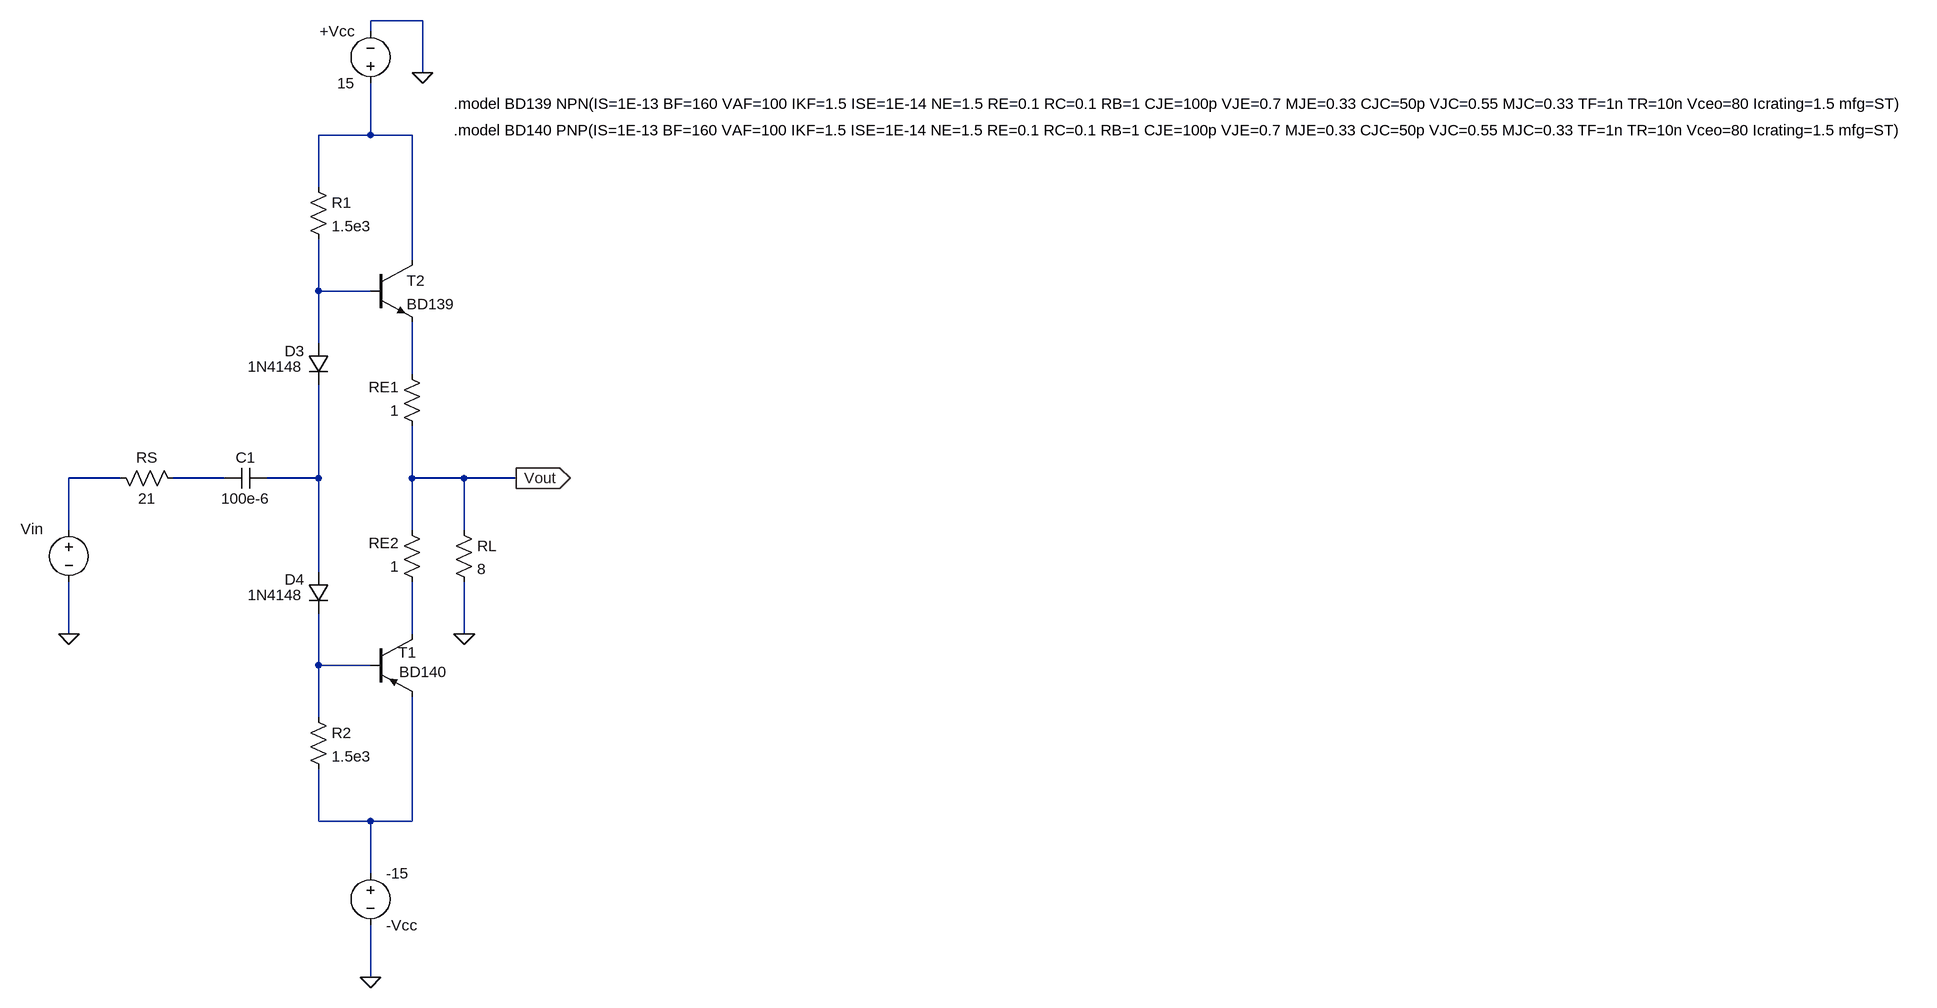
[diagram p0: schematic faz3.asc]
faz3.asc, the LTspice schematic file:
Version 4
SHEET 1 2580 1032
WIRE -688 -480 -768 -480
WIRE -768 -464 -768 -480
WIRE -688 -400 -688 -480
WIRE -768 -304 -768 -384
WIRE -768 -304 -848 -304
WIRE -704 -304 -768 -304
WIRE -848 -224 -848 -304
WIRE -704 -112 -704 -304
WIRE -848 -64 -848 -144
WIRE -768 -64 -848 -64
WIRE -848 16 -848 -64
WIRE -704 64 -704 -16
WIRE -1152 224 -1232 224
WIRE -992 224 -1072 224
WIRE -848 224 -848 80
WIRE -848 224 -928 224
WIRE -704 224 -704 144
WIRE -624 224 -704 224
WIRE -544 224 -624 224
WIRE -1232 304 -1232 224
WIRE -704 304 -704 224
WIRE -624 304 -624 224
WIRE -848 368 -848 224
WIRE -1232 464 -1232 384
WIRE -704 464 -704 384
WIRE -624 464 -624 384
WIRE -848 512 -848 432
WIRE -768 512 -848 512
WIRE -848 592 -848 512
WIRE -848 752 -848 672
WIRE -768 752 -848 752
WIRE -704 752 -704 560
WIRE -704 752 -768 752
WIRE -768 832 -768 752
WIRE -768 992 -768 912
FLAG -1232 464 0
FLAG -624 464 0
FLAG -544 224 Vout
IOPIN -544 224 Out
FLAG -688 -400 0
FLAG -768 992 0
SYMBOL cap -928 208 R90
WINDOW 0 0 32 VBottom 2
WINDOW 3 32 32 VTop 2
SYMATTR InstName C1
SYMATTR Value 100e-6
SYMBOL voltage -1232 288 R0
WINDOW 123 -74 42 Left 2
WINDOW 39 0 0 Left 0
WINDOW 0 -74 14 Left 2
WINDOW 3 -74 42 Left 2
SYMATTR InstName Vin
SYMATTR Value ""
SYMBOL res -1168 208 M90
WINDOW 0 0 56 VBottom 2
WINDOW 3 32 56 VTop 2
SYMATTR InstName RS
SYMATTR Value 21
SYMBOL npn -768 -112 R0
SYMATTR InstName T2
SYMATTR Value BD139
SYMBOL pnp -768 464 R0
WINDOW 0 43 28 Left 2
WINDOW 3 44 58 Left 2
SYMATTR InstName T1
SYMATTR Value BD140
SYMBOL res -688 160 R180
WINDOW 0 36 76 Left 2
WINDOW 3 36 40 Left 2
SYMATTR InstName RE1
SYMATTR Value 1
SYMBOL res -688 400 R180
WINDOW 0 36 76 Left 2
WINDOW 3 36 40 Left 2
SYMATTR InstName RE2
SYMATTR Value 1
SYMBOL res -640 288 R0
SYMATTR InstName RL
SYMATTR Value 8
SYMBOL voltage -768 -368 R180
WINDOW 0 24 96 Left 2
WINDOW 3 24 16 Left 2
WINDOW 123 0 0 Left 0
WINDOW 39 0 0 Left 0
SYMATTR InstName +Vcc
SYMATTR Value 15
SYMBOL voltage -768 816 R0
WINDOW 0 24 96 Left 2
WINDOW 3 24 16 Left 2
WINDOW 123 0 0 Left 0
WINDOW 39 0 0 Left 0
SYMATTR InstName -Vcc
SYMATTR Value -15
SYMBOL diode -864 16 R0
WINDOW 0 -36 12 Left 2
WINDOW 3 -93 36 Left 2
SYMATTR InstName D3
SYMATTR Value 1N4148
SYMBOL res -864 576 R0
SYMATTR InstName R2
SYMATTR Value 1.5e3
SYMBOL res -864 -240 R0
SYMATTR InstName R1
SYMATTR Value 1.5e3
SYMBOL diode -864 368 R0
WINDOW 0 -36 12 Left 2
WINDOW 3 -93 36 Left 2
SYMATTR InstName D4
SYMATTR Value 1N4148
TEXT -640 -352 Left 2 !.model BD139 NPN(IS=1E-13 BF=160 VAF=100 IKF=1.5 ISE=1E-14 NE=1.5 RE=0.1 RC=0.1 RB=1 CJE=100p VJE=0.7 MJE=0.33 CJC=50p VJC=0.55 MJC=0.33 TF=1n TR=10n Vceo=80 Icrating=1.5 mfg=ST)
TEXT -640 -312 Left 2 !.model BD140 PNP(IS=1E-13 BF=160 VAF=100 IKF=1.5 ISE=1E-14 NE=1.5 RE=0.1 RC=0.1 RB=1 CJE=100p VJE=0.7 MJE=0.33 CJC=50p VJC=0.55 MJC=0.33 TF=1n TR=10n Vceo=80 Icrating=1.5 mfg=ST)

The netlist it stands for:
* faz3.asc
C1 N006 N005 100e-6
Vin N004 0
RS N004 N005 21
Q§T2 N001 N002 N003 0 BD139
Q§T1 N007 N008 N009 0 BD140
RE1 Vout N003 1
RE2 N007 Vout 1
RL Vout 0 8
V§+Vcc N001 0 15
V§-Vcc N009 0 -15
D3 N002 N006 1N4148
R2 N008 N009 1.5e3
R1 N001 N002 1.5e3
D4 N006 N008 1N4148
.model D D
.lib standard.dio
.model NPN NPN
.model PNP PNP
.lib standard.bjt
.model BD139 NPN(IS=1E-13 BF=160 VAF=100 IKF=1.5 ISE=1E-14 NE=1.5 RE=0.1 RC=0.1 RB=1 CJE=100p VJE=0.7 MJE=0.33 CJC=50p VJC=0.55 MJC=0.33 TF=1n TR=10n Vceo=80 Icrating=1.5 mfg=ST)
.model BD140 PNP(IS=1E-13 BF=160 VAF=100 IKF=1.5 ISE=1E-14 NE=1.5 RE=0.1 RC=0.1 RB=1 CJE=100p VJE=0.7 MJE=0.33 CJC=50p VJC=0.55 MJC=0.33 TF=1n TR=10n Vceo=80 Icrating=1.5 mfg=ST)
.backanno
.end